# Altium schematic sheet CONFIG.SchDoc
size A4
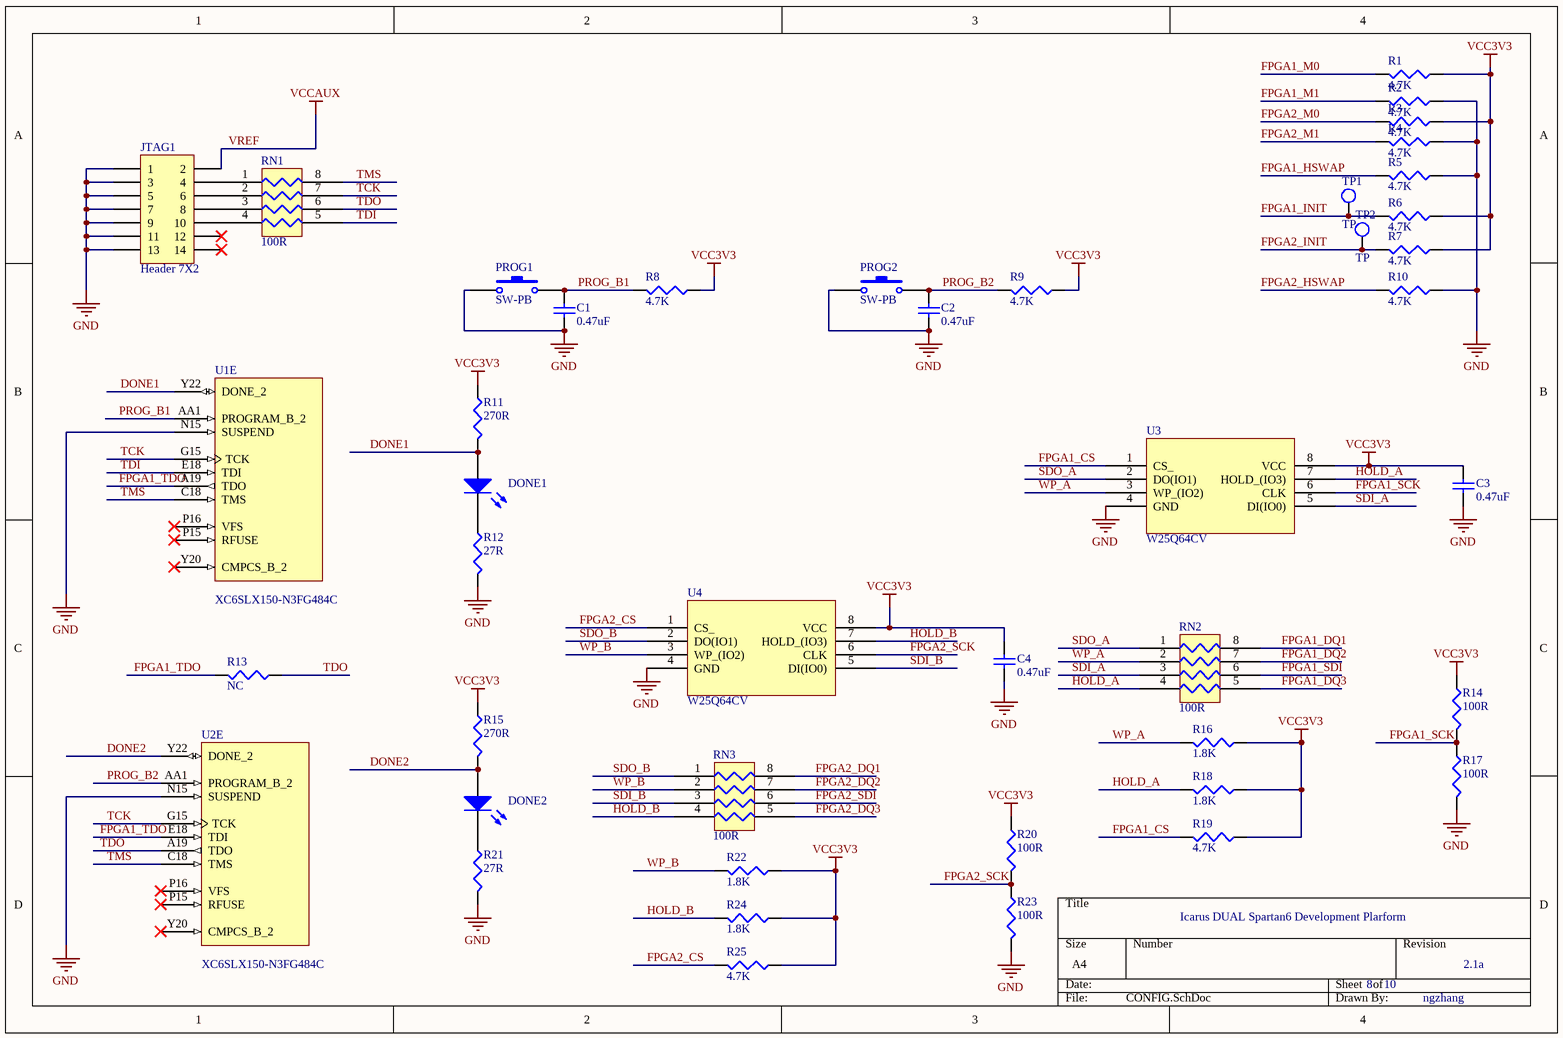
[diagram p0: CONFIG.SchDoc]

## Parts
C1  0.47uF  [0402]
C2  0.47uF  [0402]
C3  0.47uF  [0402]
C4  0.47uF  [0402]
DONE1  LED3  [CD1608-0603]  (value not drawn)
DONE2  LED3  [CD1608-0603]  (value not drawn)
JTAG1  Header 7X2  [MOLEX14P]
PROG1  SW-PB  [SW_2]
PROG2  SW-PB  [SW_2]
R1  4.7K  [0402]
R2  4.7K  [0402]
R3  4.7K  [0402]
R4  4.7K  [0402]
R5  4.7K  [0402]
R6  4.7K  [0402]
R7  4.7K  [0402]
R8  4.7K  [0402]
R9  4.7K  [0402]
R10  4.7K  [0402]
R11  270R  [0402]
R12  27R  [0402]
R13  NC  [0402]
R14  100R  [0402]
R15  270R  [0402]
R16  1.8K  [0402]
R17  100R  [0402]
R18  1.8K  [0402]
R19  4.7K  [0402]
R20  100R  [0402]
R21  27R  [0402]
R22  1.8K  [0402]
R23  100R  [0402]
R24  1.8K  [0402]
R25  4.7K  [0402]
RN1  100R  [EXBV8V]
RN2  100R  [EXBV8V]
RN3  100R  [EXBV8V]
TP1  TP  [TP]
TP2  TP  [TP]
U1  XC6SLX150-N3FG484C  [FG484]  (part E of 7)
U2  XC6SLX150-N3FG484C  [FG484]  (part E of 7)
U3  W25Q64CV  [WSON6X5]
U4  W25Q64CV  [WSON6X5]

## Nets
GND: C1.2 C2.2 C3.1 C4.1 JTAG1.1 JTAG1.3 JTAG1.5 JTAG1.7 JTAG1.9 JTAG1.11 JTAG1.13 PROG1.1 PROG2.1 R2.1 R4.1 R5.1 R10.1 R12.2 R17.2 R21.2 R23.2 U1.N15(SUSPEND) U2.N15(SUSPEND) U3.4(GND) U4.4(GND)
VCC3V3: C3.2 C4.2 R1.1 R3.1 R6.1 R7.1 R8.1 R9.1 R11.1 R14.1 R15.1 R16.1 R18.1 R19.1 R20.1 R22.1 R24.1 R25.1 U3.8(VCC) U4.8(VCC)
VREF: JTAG1.2  [also labelled VCCAUX]
DONE1: DONE1.1(A) R11.2 U1.Y22(DONE_2)
DONE2: DONE2.1(A) R15.2 U2.Y22(DONE_2)
FPGA1_CS: R19.2 U3.1(CS_)
FPGA1_DQ1: RN2.8
FPGA1_DQ2: RN2.7
FPGA1_DQ3: RN2.5
FPGA1_HSWAP: R5.2
FPGA1_INIT: R6.2 TP1.1(TP)
FPGA1_M0: R1.2
FPGA1_M1: R2.2
FPGA1_SCK: R14.2 R17.1 U3.6(CLK)
FPGA1_SDI: RN2.6
FPGA1_TDO: R13.2 U1.A19(TDO) U2.E18(TDI)
FPGA2_CS: R25.2 U4.1(CS_)
FPGA2_DQ1: RN3.8
FPGA2_DQ2: RN3.7
FPGA2_DQ3: RN3.5
FPGA2_HSWAP: R10.2
FPGA2_INIT: R7.2 TP2.1(TP)
FPGA2_M0: R3.2
FPGA2_M1: R4.2
FPGA2_SCK: R20.2 R23.1 U4.6(CLK)
FPGA2_SDI: RN3.6
HOLD_A: R18.2 RN2.4 U3.7(HOLD_(IO3))
HOLD_B: R24.2 RN3.4 U4.7(HOLD_(IO3))
PROG_B1: C1.1 PROG1.2 R8.2 U1.AA1(PROGRAM_B_2)
PROG_B2: C2.1 PROG2.2 R9.2 U2.AA1(PROGRAM_B_2)
SDI_A: RN2.3 U3.5(DI(IO0))
SDI_B: RN3.3 U4.5(DI(IO0))
SDO_A: RN2.1 U3.2(DO(IO1))
SDO_B: RN3.1 U4.2(DO(IO1))
TCK: RN1.7 U1.G15(TCK) U2.G15(TCK)
TDI: RN1.5 U1.E18(TDI)
TDO: R13.1 RN1.6 U2.A19(TDO)
TMS: RN1.8 U1.C18(TMS) U2.C18(TMS)
WP_A: R16.2 RN2.2 U3.3(WP_(IO2))
WP_B: R22.2 RN3.2 U4.3(WP_(IO2))
NetDONE1_2: DONE1.2(K) R12.1
NetDONE2_2: DONE2.2(K) R21.1
NetJTAG1_4: JTAG1.4 RN1.1
NetJTAG1_6: JTAG1.6 RN1.2
NetJTAG1_8: JTAG1.8 RN1.3
NetJTAG1_10: JTAG1.10 RN1.4

Not connected (* = marked no-connect by the designer): JTAG1 12* 14*; U1 P15(RFUSE)* P16(VFS)* Y20(CMPCS_B_2)*; U2 P15(RFUSE)* P16(VFS)* Y20(CMPCS_B_2)*

## Notes on the sheet
- Icarus DUAL Spartan6 Development Plarform
- 8
- 10
- 2.1a
- ngzhang

## Library data of the parts
C1-C4 = Cap Semi: Capacitor (Semiconductor SIM Model); Published: 8-Jun-2000; LatestRevisionDate: 29-May-2009; LatestRevisionNote: IPC-7351 Footprint Added.; PackageReference: C1206; Publisher: Altium Limited; PackageDescription: Chip Capacitor; Value: 0.47uF
DONE1 DONE2 = LED3: Typical BLUE SiC LED; Published: 8-Jun-2000; LatestRevisionDate: 17-Dec-2003; LatestRevisionNote: PCB Footprint replaced.; DatasheetVersion: 16-Apr-2002; PackageVersion: 16-Apr-2002; PackageReference: 3.5X2.8X1.9; Publisher: Altium Limited; PackageDescription: SM LED; 2 C-Bend Leads; Body 3.5 x 2.8 x 1.9 mm, inc leads (LxWxH typ)
JTAG1 = Header 7X2: Header, 7-Pin, Dual row; LatestRevisionDate: 17-Jul-2002; LatestRevisionNote: Re-released for DXP Platform.; Publisher: Altium Limited
PROG1 PROG2 = SW-PB: Switch; Published: 24-Mar-1999; LatestRevisionDate: 17-Jul-2002; LatestRevisionNote: Re-released for DXP Platform.; PackageReference: SPST-2; Publisher: Altium Limited; PackageDescription: Switch; 2 Leads
R1-R25 = Res3: Resistor; Published: 8-Jun-2000; LatestRevisionDate: 29-May-2009; LatestRevisionNote: IPC-7351 Footprint Added.; PackageReference: J1-0603; Publisher: Altium Limited; PackageDescription: Chip Resistor
  R1-R10 R19 R25: Value: 4.7K
  R11 R15: Value: 270R
  R12 R21: Value: 27R
  R13: Value: NC
  R14 R17 R20 R23: Value: 100R
  R16 R18 R22 R24: Value: 1.8K
RN1-RN3 = RES4PACK
U1 U2 = XC6SLX150-N3FG484C: Spartan-6 LX 1.2V FPGA, 338 User I/Os, 484-Ball Fine-Pitch BGA (1.0mm Pitch), Speed Grade 3N, Commercial Grade; Published: 24-Aug-2010; DatasheetVersion: ver1.6, Nov-2010; PackageVersion: ver1.1, Dec-2008; PackageReference: FG484; Publisher: Altium Limited; PackageDescription: 484-Ball Fine Pitch Ball Grid Array 1.00 mm Pitch (FG484); Code_JEDEC: MS-034-AAJ-1; Code_IPC: BGA100P22X22-484; ComponentLink1Description: Manufacturer Link; ComponentLink1URL: http://www.xilinx.com; ComponentLink2Description: Spartan-6 Datasheet; ComponentLink2URL: http://www.xilinx.com/support/documentation/data_sheets/ds160.pdf; ComponentLink3Description: Spartan-6 Documents; ComponentLink3URL: http://www.xilinx.com/support/documentation/spartan-6.htm; ComponentLink4Description: Xilinx.com Home; ComponentLink4URL: http://www.xilinx.com